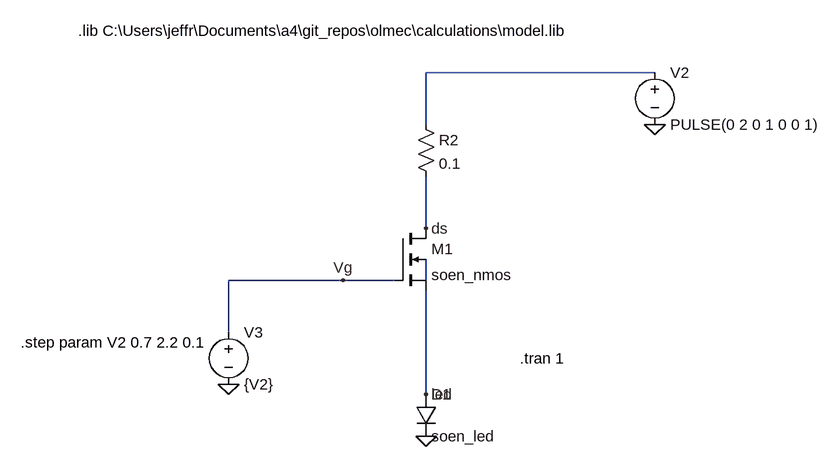
[diagram p0: schematic Draft1.asc]
Draft1.asc, the LTspice schematic file:
Version 4
SHEET 1 880 680
WIRE 80 -16 -272 -16
WIRE -272 64 -272 -16
WIRE -272 224 -272 144
WIRE -400 304 -576 304
WIRE -320 304 -400 304
WIRE -272 304 -272 272
WIRE -576 384 -576 304
WIRE -272 480 -272 320
FLAG -272 544 0
FLAG -272 480 led
FLAG 80 64 0
FLAG -576 464 0
FLAG -272 224 ds
FLAG -400 304 Vg
SYMBOL diode -288 480 R0
SYMATTR InstName D1
SYMATTR Value soen_led
SYMBOL voltage 80 -32 R0
WINDOW 123 0 0 Left 0
WINDOW 39 0 0 Left 0
SYMATTR InstName V2
SYMATTR Value PULSE(0 2 0 1 0 0 1)
SYMBOL voltage -576 368 R0
WINDOW 123 0 0 Left 0
WINDOW 39 0 0 Left 0
SYMATTR InstName V3
SYMATTR Value {V2}
SYMBOL res -288 48 R0
SYMATTR InstName R2
SYMATTR Value 0.1
SYMBOL nmos4 -320 224 R0
SYMATTR InstName M1
SYMATTR Value soen_nmos
TEXT -128 424 Left 2 !.tran 1
TEXT -896 400 Left 2 !.step param V2 0.7 2.2 0.1
TEXT -808 -80 Left 2 !.lib C:\\Users\\jeffr\\Documents\\a4\\git_repos\\olmec\\calculations\\model.lib

The netlist it stands for:
* Draft1.asc
D1 led 0 soen_led
V2 N001 0 PULSE(0 2 0 1 0 0 1)
V3 Vg 0 {V2}
R2 N001 ds 0.1
M1 ds Vg led N002 soen_nmos
.model D D
.lib standard.dio
.model NMOS NMOS
.model PMOS PMOS
.lib standard.mos
.tran 1
.step param V2 0.7 2.2 0.1
.lib C:\Users\jeffr\Documents\a4\git_repos\olmec\calculations\model.lib
.backanno
.end